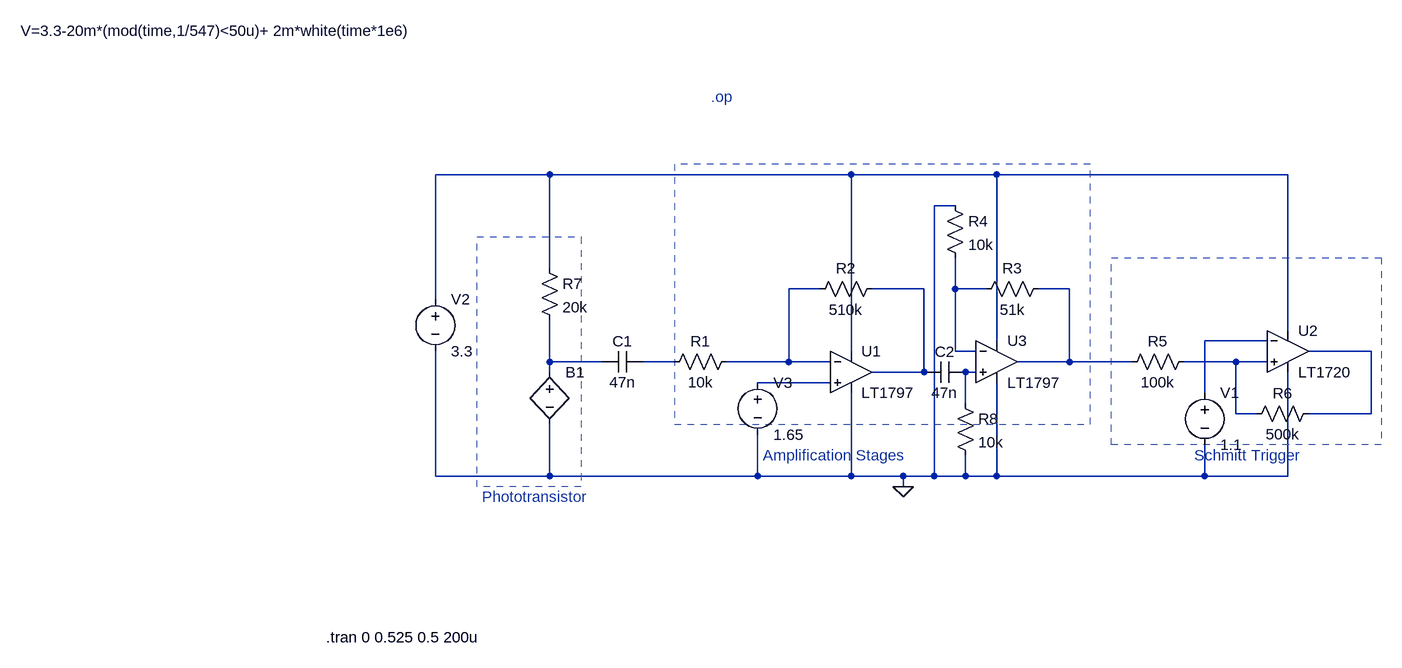
[diagram p0: schematic IR Sensor Final 2.asc]
IR Sensor Final 2.asc, the LTspice schematic file:
Version 4.1
SHEET 1 1124 680
WIRE -160 -128 -336 -128
WIRE 304 -128 -160 -128
WIRE 528 -128 304 -128
WIRE 976 -128 528 -128
WIRE 464 -80 432 -80
WIRE -160 16 -160 -128
WIRE 256 48 208 48
WIRE 416 48 336 48
WIRE 464 48 464 0
WIRE 512 48 464 48
WIRE 640 48 592 48
WIRE -336 64 -336 -128
WIRE 976 112 976 -128
WIRE 528 128 528 -128
WIRE 944 128 848 128
WIRE 304 144 304 -128
WIRE 464 144 464 48
WIRE 496 144 464 144
WIRE 1104 144 1008 144
WIRE -160 160 -160 96
WIRE -80 160 -160 160
WIRE 32 160 -16 160
WIRE 208 160 208 48
WIRE 208 160 112 160
WIRE 272 160 208 160
WIRE 640 160 640 48
WIRE 640 160 560 160
WIRE 736 160 640 160
WIRE 896 160 816 160
WIRE 944 160 896 160
WIRE -160 176 -160 160
WIRE 416 176 416 48
WIRE 416 176 336 176
WIRE 496 176 480 176
WIRE 272 192 160 192
WIRE 848 208 848 128
WIRE 480 224 480 176
WIRE 896 240 896 160
WIRE 928 240 896 240
WIRE 1104 240 1104 144
WIRE 1104 240 1008 240
WIRE -336 336 -336 144
WIRE -160 336 -160 256
WIRE -160 336 -336 336
WIRE 160 336 160 272
WIRE 160 336 -160 336
WIRE 304 336 304 208
WIRE 304 336 160 336
WIRE 384 336 304 336
WIRE 432 336 432 -80
WIRE 432 336 384 336
WIRE 480 336 480 304
WIRE 480 336 432 336
WIRE 528 336 528 192
WIRE 528 336 480 336
WIRE 848 336 848 288
WIRE 848 336 528 336
WIRE 976 336 976 176
WIRE 976 336 848 336
WIRE 384 352 384 336
FLAG 384 352 0
SYMBOL OpAmps\\LT1797 304 112 R0
SYMATTR InstName U1
SYMBOL Comparators\\LT1720 976 80 R0
SYMATTR InstName U2
SYMBOL res 128 144 R90
WINDOW 0 0 56 VBottom 2
WINDOW 3 32 56 VTop 2
SYMATTR InstName R1
SYMATTR Value 10k
SYMBOL res 352 32 R90
WINDOW 0 0 56 VBottom 2
WINDOW 3 32 56 VTop 2
SYMATTR InstName R2
SYMATTR Value 510k
SYMBOL OpAmps\\LT1797 528 96 R0
SYMATTR InstName U3
SYMBOL res 608 32 R90
WINDOW 0 0 56 VBottom 2
WINDOW 3 32 56 VTop 2
SYMATTR InstName R3
SYMATTR Value 51k
SYMBOL res 448 -96 R0
SYMATTR InstName R4
SYMATTR Value 10k
SYMBOL res 832 144 R90
WINDOW 0 0 56 VBottom 2
WINDOW 3 32 56 VTop 2
SYMATTR InstName R5
SYMATTR Value 100k
SYMBOL res 1024 224 R90
WINDOW 0 0 56 VBottom 2
WINDOW 3 32 56 VTop 2
SYMATTR InstName R6
SYMATTR Value 500k
SYMBOL cap -16 144 R90
WINDOW 0 0 32 VBottom 2
WINDOW 3 32 32 VTop 2
SYMATTR InstName C1
SYMATTR Value 47n
SYMBOL voltage 848 192 R0
WINDOW 123 0 0 Left 0
WINDOW 39 0 0 Left 0
SYMATTR InstName V1
SYMATTR Value 1.1
SYMBOL voltage -336 48 R0
SYMATTR InstName V2
SYMATTR Value 3.3
SYMBOL bv -160 160 R0
WINDOW 3 -814 -509 Left 2
SYMATTR Value V=3.3-20m*(mod(time,1/547)<50u)+ 2m*white(time*1e6)
SYMATTR InstName B1
SYMBOL voltage 160 176 R0
WINDOW 123 0 0 Left 0
WINDOW 39 0 0 Left 0
SYMATTR InstName V3
SYMATTR Value 1.65
SYMBOL cap 480 160 R90
WINDOW 0 0 32 VBottom 2
WINDOW 3 32 32 VTop 2
SYMATTR InstName C2
SYMATTR Value 47n
SYMBOL res -176 0 R0
SYMATTR InstName R7
SYMATTR Value 20k
SYMBOL res 464 208 R0
SYMATTR InstName R8
SYMATTR Value 10k
TEXT -504 584 Left 2 !.tran 0 0.525 0.5 200u
TEXT -264 368 Left 2 ;Phototransistor
TEXT 168 304 Left 2 ;Amplification Stages
TEXT 832 304 Left 2 ;Schmitt Trigger
TEXT 88 -248 Left 2 ;.op
RECTANGLE Normal -112 352 -272 -32 2
RECTANGLE Normal 1120 288 704 0 2
RECTANGLE Normal 32 256 672 -144 2
RECTANGLE Normal -272 -32 -272 -32 2

The netlist it stands for:
* IR Sensor Final 2.asc
X§U1 N012 N002 N001 0 N003 LT1797  ; pins In+ In- V+ V- OUT
X§U2 N010 N006 N001 0 N007 LT1720  ; pins In+ In- V+ V- OUT
R1 N002 N009 10k
R2 N003 N002 510k
X§U3 N011 N004 N001 0 N005 LT1797  ; pins In+ In- V+ V- OUT
R3 N005 N004 51k
R4 0 N004 10k
R5 N010 N005 100k
R6 N007 N010 500k
C1 N009 N008 47n
V1 N006 0 1.1
V2 N001 0 3.3
B1 N008 0 V=3.3-20m*(mod(time,1/547)<50u)+ 2m*white(time*1e6)
V3 N012 0 1.65
C2 N011 N003 47n
R7 N001 N008 20k
R8 N011 0 10k
.tran 0 0.525 0.5 200u
* Phototransistor
* Amplification Stages
* Schmitt Trigger
* .op
.lib LT1720.sub
.backanno
.end